# EasyEDA Pro project Schematic.epro

# Schematic Schematic1
Board Name: Board1; Create Date: 2025-12-14; Page Name: P1; Project Name: Mudskipper Inspired Soft Robot; Schematic Name: Schematic1; Update Date: 2025-12-16; Company: EasyEDA.com; Page Size: A4; Version: V1.0
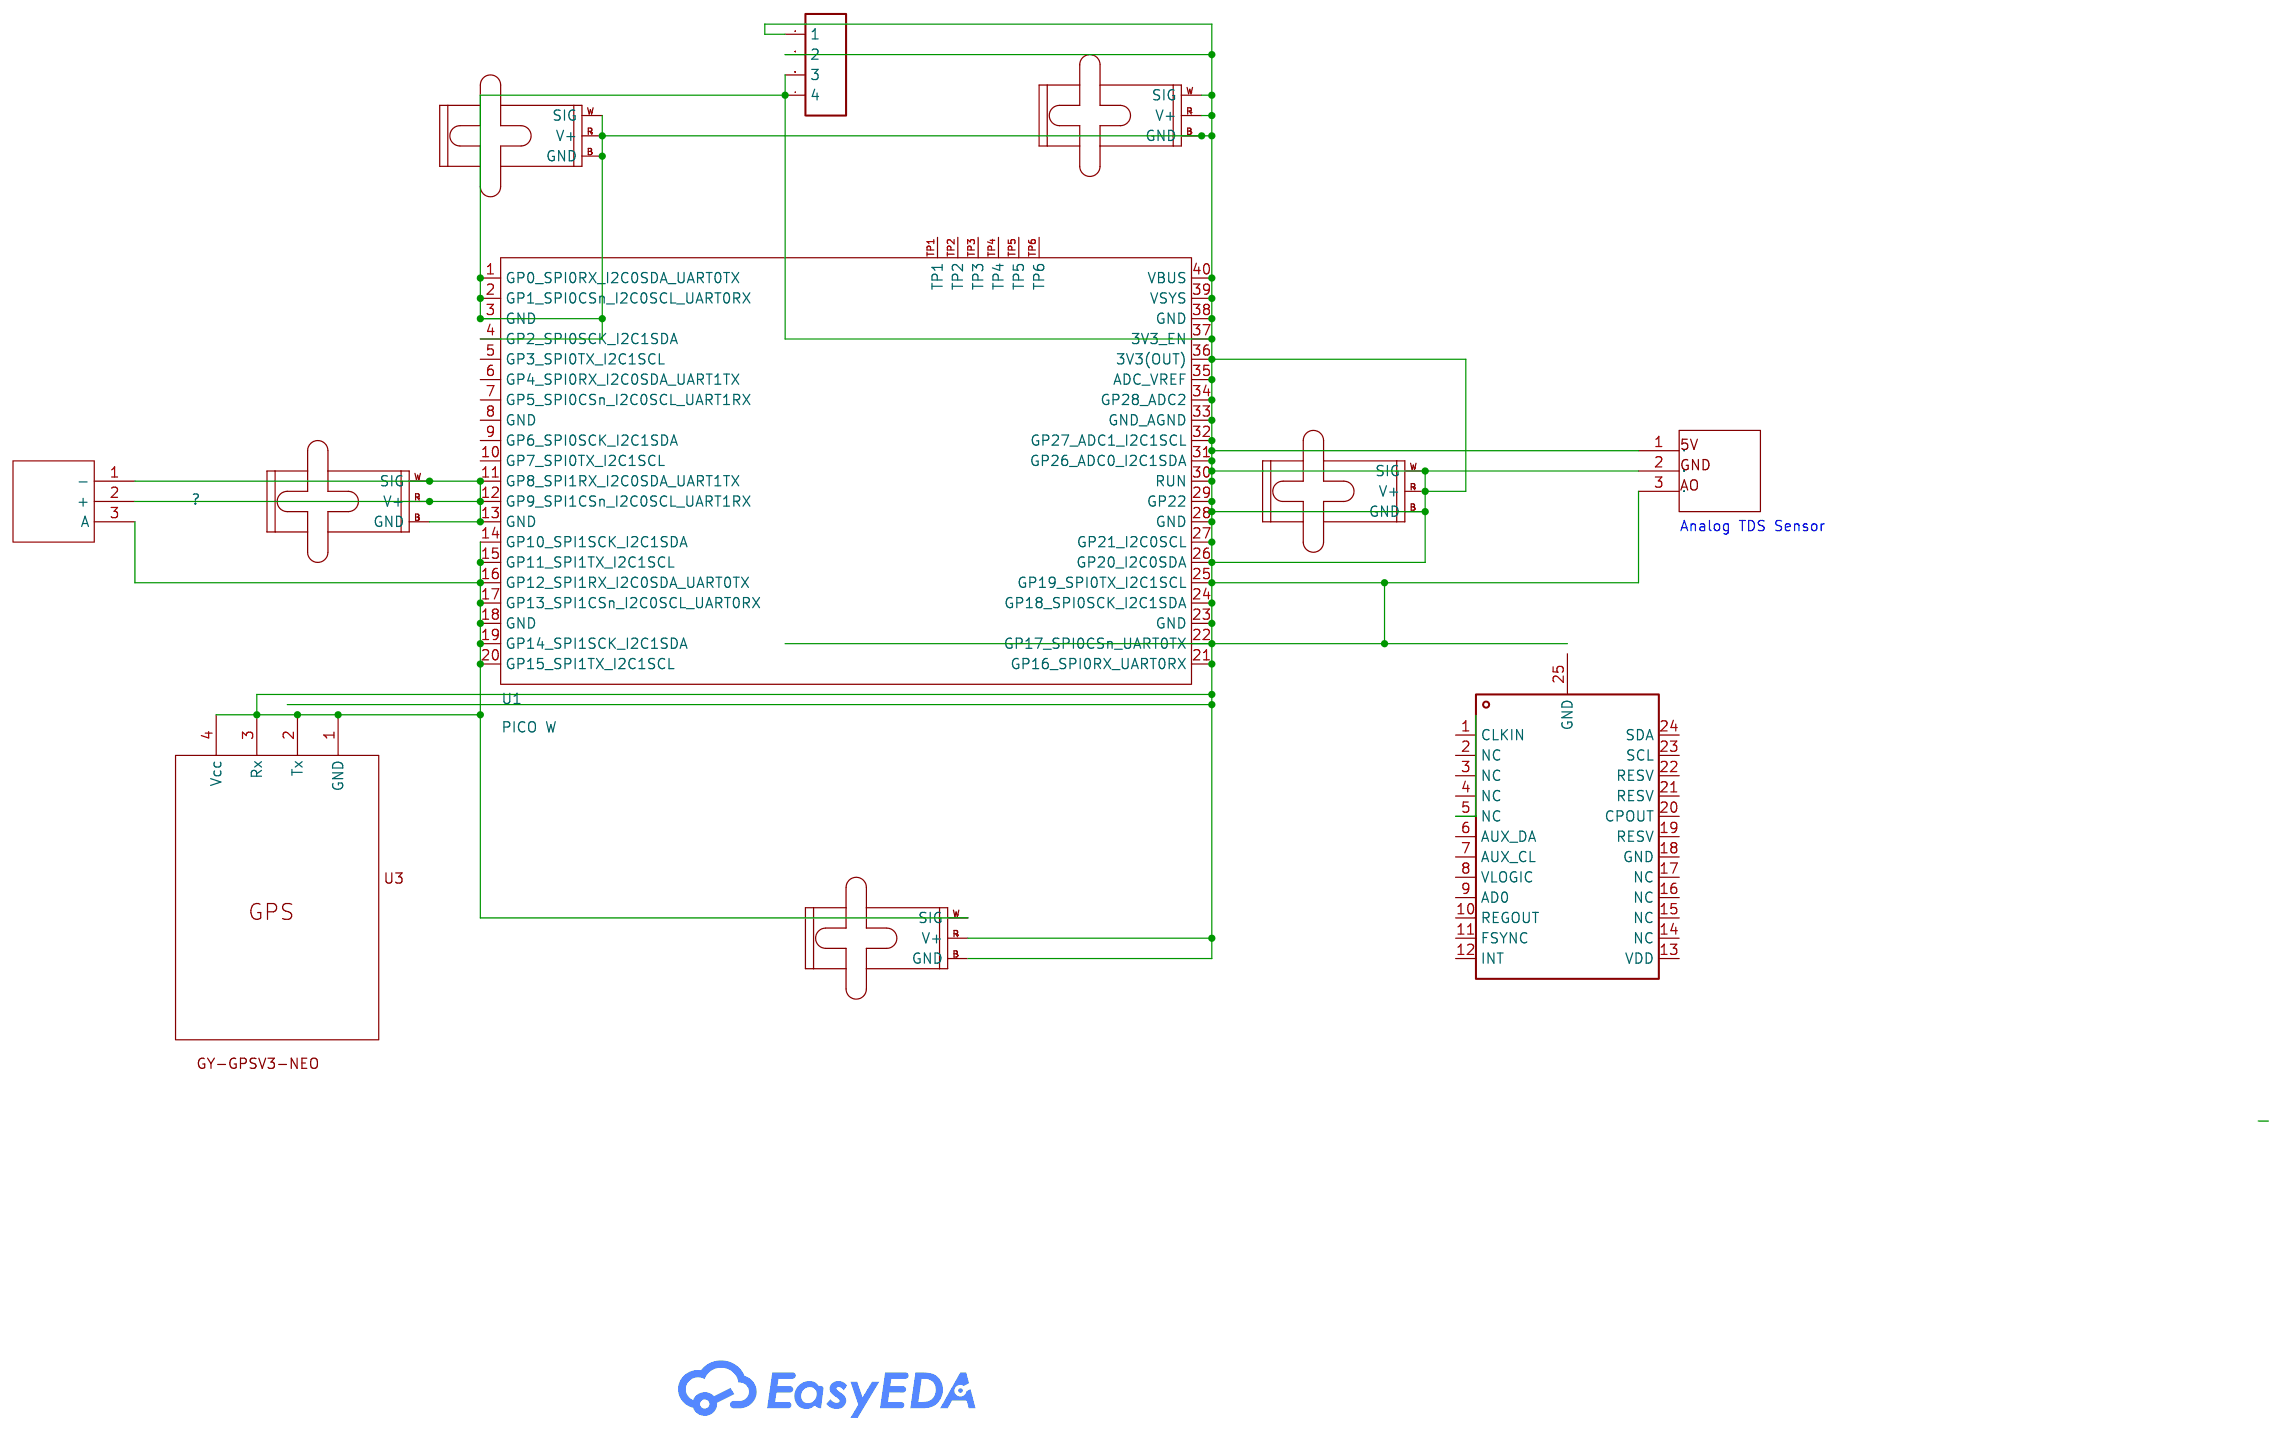
[diagram p0: schematic sheet]

## Parts
?#1  -
H1  ULTRASONIC  [HDR-F-2.54_1X4]
M1  SMALL_SERVO  [Servo motor]
M2  SMALL_SERVO  [Servo motor]
M3  SMALL_SERVO  [Servo motor]
M4  SMALL_SERVO  [Servo motor]
M5  SMALL_SERVO  [Servo motor]
U1  PICO W  [COMM-SMD_L51.0-W21.0-P2.54_PICOW]
U2  -
U3  MPU-6050_C24112  [QFN-24_L4.0-W4.0-P0.50-BL-EP2.7]
U4  -  [GY-GPSV3-NEO]

## Library data of the parts
?#1 = DFRobot pH Sensor
H1 = ULTRASONIC: Supplier Part: C225501; Supplier: LCSC
M1-M5 = Servo motor: Manufacturer Part: ?
U1 = PICO W: Supplier Part: C7203003; Manufacturer: Raspberry Pi(树莓派); JLCPCB Part Class: Extended Part; Datasheet: https://item.szlcsc.com/datasheet/PICO%2520W/8170961.html; Supplier: LCSC
U2 = Analog TDS Sensor
U3 = MPU-6050_C24112: link: https://item.szlcsc.com/245167.html; 3DModel: QFN-24_L4.0-W4.0-H0.9-P0.50-; Supplier: LCSC; Manufacturer: InvenSense; Manufacturer Part: MPU-6050; Supplier Part: C24112; JLCPCB Part Class: Basic Part
U4 = gps module

## Nets
Net-(?#1-1): ?#1.1(-) ?#1.2(+) M4.1(SIG) M4.2(V+) M4.3(GND) U1.11(GP8_SPI1RX_I2C0SDA_UART1TX) U1.12(GP9_SPI1CSn_I2C0SCL_UART1RX) U1.13(GND)
Net-(?#1-3): ?#1.3(A) H1.1 H1.2 H1.3 H1.4 M1.1(SIG) M1.2(V+) M1.3(GND) M2.1(SIG) M2.2(V+) M2.3(GND) M3.1(SIG) M3.2(V+) M3.3(GND) M5.1(SIG) M5.2(V+) M5.3(GND) U1.1(GP0_SPI0RX_I2C0SDA_UART0TX) U1.2(GP1_SPI0CSn_I2C0SCL_UART0RX) U1.3(GND) U1.4(GP2_SPI0SCK_I2C1SDA) U1.14(GP10_SPI1SCK_I2C1SDA) U1.15(GP11_SPI1TX_I2C1SCL) U1.16(GP12_SPI1RX_I2C0SDA_UART0TX) U1.17(GP13_SPI1CSn_I2C0SCL_UART0RX) U1.18(GND) U1.19(GP14_SPI1SCK_I2C1SDA) U1.20(GP15_SPI1TX_I2C1SCL) U1.21(GP16_SPI0RX_UART0RX) U1.22(GP17_SPI0CSn_UART0TX) U1.23(GND) U1.24(GP18_SPI0SCK_I2C1SDA) U1.25(GP19_SPI0TX_I2C1SCL) U1.26(GP20_I2C0SDA) U1.27(GP21_I2C0SCL) U1.28(GND) U1.29(GP22) U1.30(RUN) U1.31(GP26_ADC0_I2C1SDA) U1.32(GP27_ADC1_I2C1SCL) U1.33(GND_AGND) U1.34(GP28_ADC2) U1.35(ADC_VREF) U1.36(3V3(OUT)) U1.37(3V3_EN) U1.38(GND) U1.39(VSYS) U1.40(VBUS) U2.1 U2.2 U2.3 U4.1(GND) U4.2(Tx) U4.3(Rx) U4.4(Vcc)

Not connected (* = marked no-connect by the designer): U1 5(GP3_SPI0TX_I2C1SCL) 6(GP4_SPI0RX_I2C0SDA_UART1TX) 7(GP5_SPI0CSn_I2C0SCL_UART1RX) 8(GND) 9(GP6_SPI0SCK_I2C1SDA) 10(GP7_SPI0TX_I2C1SCL) TP1 TP2 TP3 TP4 TP5 TP6; U3 1(CLKIN) 2(NC) 3(NC) 4(NC) 5(NC) 6(AUX_DA) 7(AUX_CL) 8(VLOGIC) 9(AD0) 10(REGOUT) 11(FSYNC) 12(INT) 13(VDD) 14(NC) 15(NC) 16(NC) 17(NC) 18(GND) 19(RESV) 20(CPOUT) 21(RESV) 22(RESV) 23(SCL) 24(SDA) 25(GND)
